# Altium schematic sheet NBT_XDATA_MUX.SCHDOC
size A4; Organization: Altium Limited; Address1: L3, 12a Rodborough Rd; Address2: Frenchs Forest; Address3: NSW; Address4: Australia 2086; DocumentNumber: 6; SheetNumber: 6; SheetTotal: 12
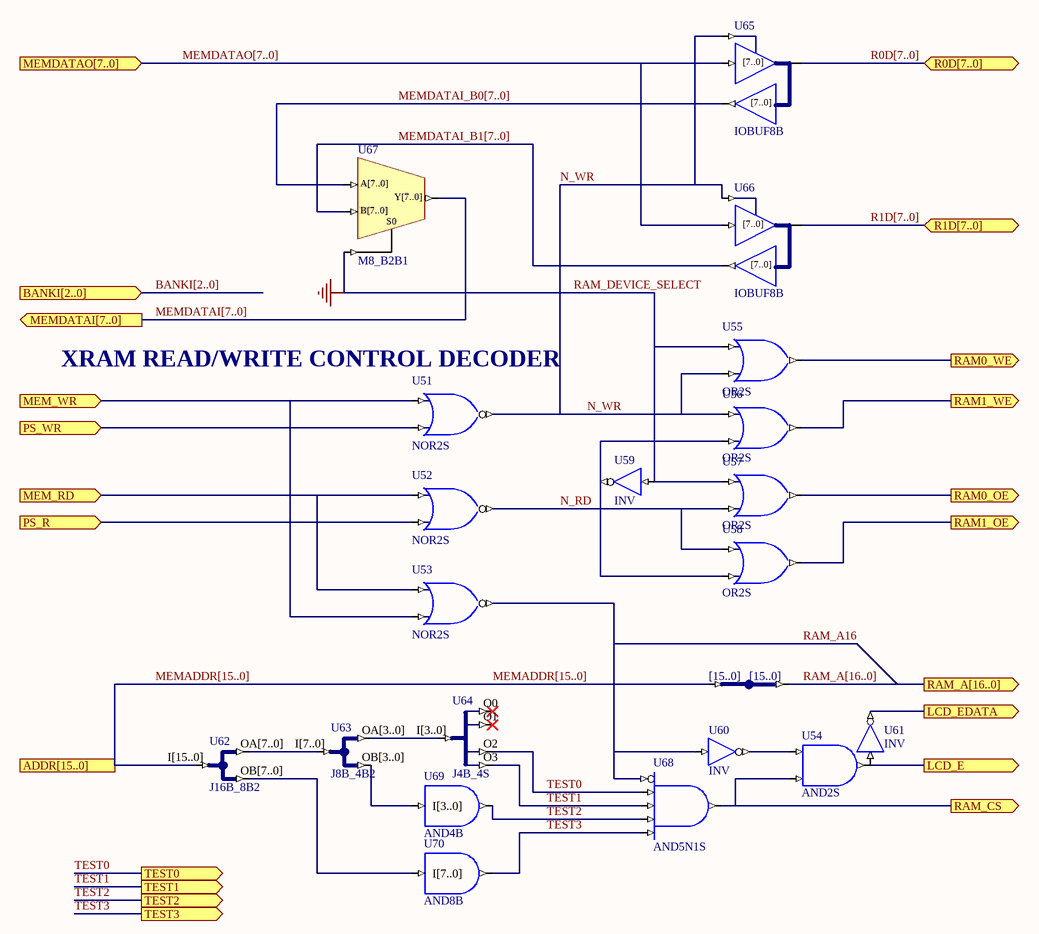
[diagram p0: NBT_XDATA_MUX.SCHDOC]

## Parts
JB_S3  IndexA: [15..0]  (hidden comment: JB)
U51  NOR2S
U52  NOR2S
U53  NOR2S
U54  AND2S
U55  OR2S
U56  OR2S
U57  OR2S
U58  OR2S
U59  INV
U60  INV
U61  INV
U62  J16B_8B2
U63  J8B_4B2
U64  J4B_4S
U65  IOBUF8B
U66  IOBUF8B
U67  M8_B2B1
U68  AND5N1S
U69  AND4B
U70  AND8B

## Ports
ADDR[15..0] (in), BANKI[2..0] (in), LCD_E (out), LCD_EDATA (out), MEM_RD (in), MEM_WR (in), MEMDATAI[7..0] (out), MEMDATAO[7..0] (in), PS_R (in), PS_WR (in), R0D[7..0] (bidir), R1D[7..0] (bidir), RAM0_OE (out), RAM0_WE (out), RAM1_OE (out), RAM1_WE (out), RAM_A[16..0] (out), RAM_CS (out), TEST0 (out), TEST1 (out), TEST2 (out), TEST3 (out)

## Nets
RAM_DEVICE_SELECT: U55.I0 U57.I0 U59.I U67.S0  [also labelled GND]
LCD_E: U54.O U61.I ; port LCD_E
LCD_EDATA: U61.O ; port LCD_EDATA
MEM_RD: U52.I0 U53.I0 ; port MEM_RD
MEM_WR: U51.I0 U53.I1 ; port MEM_WR
MEMADDR[15..0]: JB_S3.A[0..0](IA[0..0]) U62.I[15..0] ; port ADDR[15..0]
MEMDATAI[7..0]: U67.Y[7..0] ; port MEMDATAI[7..0]
MEMDATAI_B0[7..0]: U65.O[7..0] U67.A[7..0]
MEMDATAI_B1[7..0]: U66.O[7..0] U67.B[7..0]
MEMDATAO[7..0]: U65.I[7..0] U66.I[7..0] ; port MEMDATAO[7..0]
N_RD: U52.O U57.I1 U58.I0
N_WR: U51.O U55.I1 U56.I0 U65.T U66.T
PS_R: U52.I1 ; port PS_R
PS_WR: U51.I1 ; port PS_WR
R0D[7..0]: U65.IO[7..0] ; port R0D[7..0]
R1D[7..0]: U66.IO[7..0] ; port R1D[7..0]
RAM0_OE: U57.O ; port RAM0_OE
RAM0_WE: U55.O ; port RAM0_WE
RAM1_OE: U58.O ; port RAM1_OE
RAM1_WE: U56.O ; port RAM1_WE
RAM_A16: U53.O U60.I U68.I0
RAM_A[16..0]: JB_S3.B[0..0] ; port RAM_A[16..0]
RAM_CS: U54.I1 U68.O ; port RAM_CS
TEST0: U64.O2 U68.I1 ; port TEST0
TEST1: U64.O3 U68.I2 ; port TEST1
TEST2: U68.I3 U69.O ; port TEST2
TEST3: U68.I4 U70.O ; port TEST3
NetU54_I0: U54.I0 U60.O
NetU56_I1: U56.I1 U58.I1 U59.O
NetU62_OA[7..0]: U62.OA[7..0] U63.I[7..0]
NetU62_OB[7..0]: U62.OB[7..0] U70.I[7..0]
NetU63_OA[3..0]: U63.OA[3..0] U64.I[3..0]
NetU63_OB[3..0]: U63.OB[3..0] U69.I[3..0]

Not connected (* = marked no-connect by the designer): U64 O0* O1*

## Buses and harness runs
bus BANKI[2..0] = port BANKI[2..0]
bus MEMADDR[15..0] = port ADDR[15..0]
bus MEMDATAI[7..0] = port MEMDATAI[7..0]
bus MEMDATAI_B0[7..0]
bus MEMDATAI_B1[7..0]
bus MEMDATAO[7..0] = port MEMDATAO[7..0]
bus R0D[7..0] = port R0D[7..0]
bus R1D[7..0] = port R1D[7..0]
bus RAM_A[16..0] = port RAM_A[16..0]

## Notes on the sheet
- (near U51) XRAM READ/WRITE CONTROL DECODER
- Title
- Size:
- Date:
- A4
- Number:
- Time:
- Revision:
- Sheet
- of
- File:
- (in symbol IOBUF8B) [7..0]

## Library data of the parts
JB_S3 = JB: System Joiner; ArchiveName: GENERIC; Published: 7-Nov-2003; Publisher: Altium Limited; Core Revision: 1.00.00; IndexB: [15..0]
U51-U53 = NOR2S: 2-Input NOR Gate, Single Pin Version; Xilinx Equivalent: NOR2; ArchiveName: GENERIC; Published: 7-Nov-2003; Publisher: Altium Limited; Core Revision: 1.00.00
U54 = AND2S: 2-Input AND Gate, Single Pin Version; Xilinx Equivalent: AND2; ArchiveName: GENERIC; Published: 7-Nov-2003; Publisher: Altium Limited; Core Revision: 1.00.00
U55-U58 = OR2S: 2-Input OR Gate, Single Pin Version; Xilinx Equivalent: OR2; ArchiveName: GENERIC; Published: 7-Nov-2003; Publisher: Altium Limited; Core Revision: 1.00.00
U59-U61 = INV: Inverter; ArchiveName: GENERIC; Published: 7-Nov-2003; Publisher: Altium Limited; Xilinx Equivalent: INV; Core Revision: 1.00.00
U62 = J16B_8B2: 1 x 16-bit input bus to 2 x 8-Bit output bus; ArchiveName: GENERIC; Published: 7-Nov-2003; Publisher: Altium Limited; Core Revision: 1.00.00
U63 = J8B_4B2: 1 x 8-bit input bus to 2 x 4-Bit output bus; ArchiveName: GENERIC; Published: 7-Nov-2003; Publisher: Altium Limited; Core Revision: 1.00.00
U64 = J4B_4S: 4-Bit input bus to 4 Single pin outputs; ArchiveName: GENERIC; Published: 7-Nov-2003; Publisher: Altium Limited; Core Revision: 1.00.00
U65 U66 = IOBUF8B: 8-Bit Input/Output Buffer, Bus Version, Bus Version; ArchiveName: GENERIC; Published: 7-Nov-2003; Publisher: Altium Limited; Core Revision: 1.00.00
U67 = M8_B2B1: 2x8-Bit Bus to 1x8-Bit Bus Multiplexer; ArchiveName: GENERIC; Published: 7-Nov-2003; Publisher: Altium Limited; Core Revision: 1.00.00
U68 = AND5N1S: 5-Input AND Gate with Active Low A Input, Single Pin Version; Xilinx Equivalent: AND5B1; ArchiveName: GENERIC; Published: 7-Nov-2003; Publisher: Altium Limited; Core Revision: 1.00.00
U69 = AND4B: 4-Input AND Gate, Bus Version; ArchiveName: GENERIC; Published: 7-Nov-2003; Publisher: Altium Limited; Core Revision: 1.00.00
U70 = AND8B: 8-Input AND Gate, Bus Version; ArchiveName: GENERIC; Published: 7-Nov-2003; Publisher: Altium Limited; Core Revision: 1.00.00